# EAGLE design untitled (EAGLE 9.5.0)
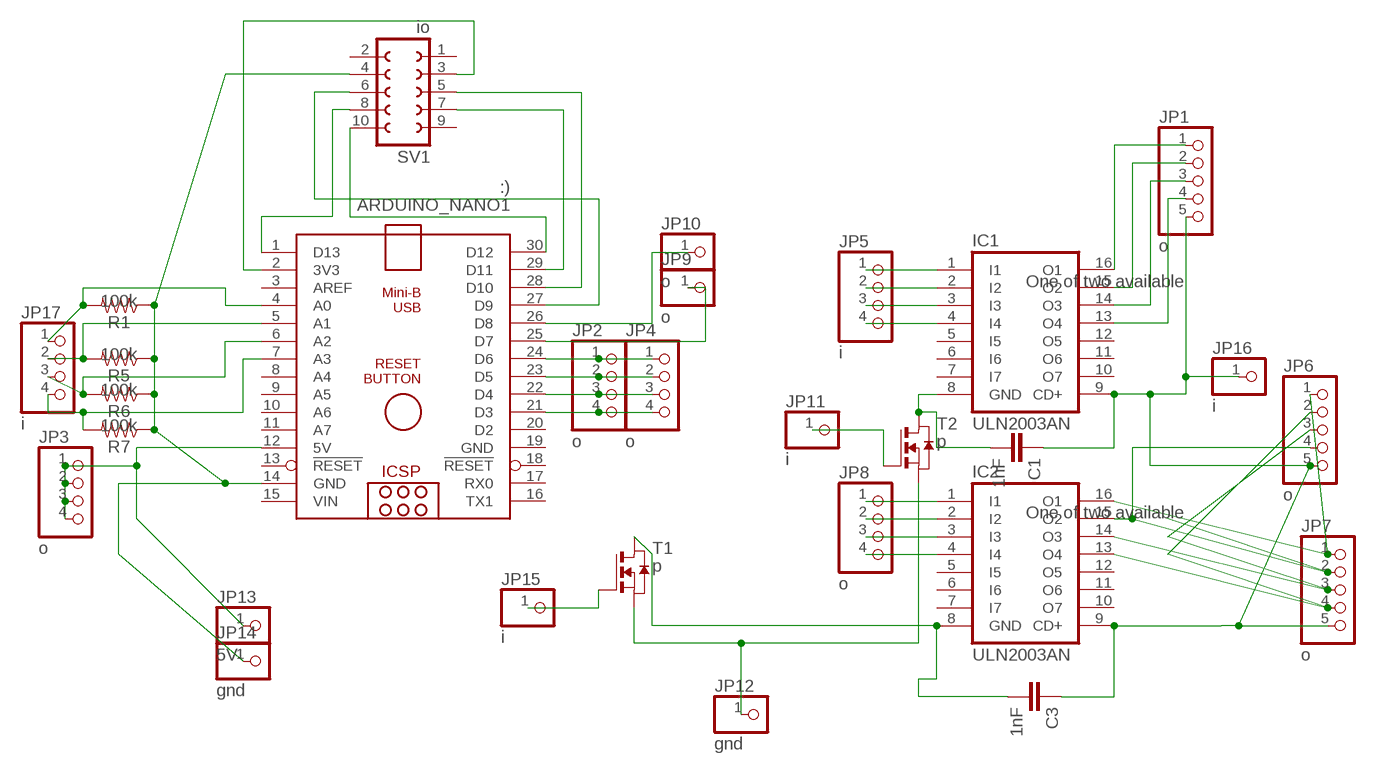
[diagram p0: schematic, sheet 1]

## Parts
ARDUINO_NANO1  :)  ARDUINO_NANO  [ARDUINO_NANO]
C1  1nF  1.0NF/1000PF-0603-50V-10%  [0603]
C3  1nF  1.0NF/1000PF-0603-50V-10%  [0603]
IC1  ULN2003AN  [DIL16]
IC2  ULN2003AN  [DIL16]
JP1  o  PINHD-1X5  [1X05]
JP2  o  PINHD-1X4  [1X04]
JP3  o  PINHD-1X4  [1X04]
JP4  o  PINHD-1X4  [1X04]
JP5  i  PINHD-1X4  [1X04]
JP6  o  PINHD-1X5  [1X05]
JP7  o  PINHD-1X5  [1X05]
JP8  o  PINHD-1X4  [1X04]
JP9  o  PINHD-1X1  [1X01]
JP10  o  PINHD-1X1  [1X01]
JP11  i  PINHD-1X1  [1X01]
JP12  gnd  PINHD-1X1  [1X01]
JP13  5V  PINHD-1X1  [1X01]
JP14  gnd  PINHD-1X1  [1X01]
JP15  i  PINHD-1X1  [1X01]
JP16  i  PINHD-1X1  [1X01]
JP17  i  PINHD-1X4  [1X04]
R1  100k  100KOHM-0603-1/10W-1%  [0603]
R5  100k  100KOHM-0603-1/10W-1%  [0603]
R6  100k  100KOHM-0603-1/10W-1%  [0603]
R7  100k  100KOHM-0603-1/10W-1%  [0603]
SV1  io  FE05-2  [FE05-2]
T1  p  NMOSSOT89  [SOT89]
T2  p  NMOSSOT89  [SOT89]

## Nets
3V3: ARDUINO_NANO1.1(D13) SV1.8
GND1: ARDUINO_NANO1.14(GND) JP14.1 R1.1 R5.1 R6.1 R7.1 SV1.4
GND2: JP12.1 T1.3(S) T2.3(S)
LONGTHINGY: IC2.15(O2) JP6.4 JP7.2
N$1: ARDUINO_NANO1.4(A0) JP17.1 R1.2
N$3: ARDUINO_NANO1.21(D3) JP2.4 JP4.4
N$4: ARDUINO_NANO1.30(D12) SV1.10
N$6: IC2.16(O1) JP6.1 JP7.1
N$8: IC2.14(O3) JP6.3 JP7.3
N$9: IC2.13(O4) JP6.2 JP7.4
N$11: IC1.16(O1) JP1.1
N$12: IC1.15(O2) JP1.2
N$13: IC1.14(O3) JP1.3
N$14: IC1.13(O4) JP1.4
N$15: ARDUINO_NANO1.22(D4) JP2.3 JP4.3
N$17: ARDUINO_NANO1.25(D7) JP9.1
N$18: ARDUINO_NANO1.23(D5) JP2.2 JP4.2
N$21: ARDUINO_NANO1.29(D11) SV1.7
N$22: ARDUINO_NANO1.28(D10) SV1.5
N$23: ARDUINO_NANO1.27(D9) SV1.6
N$24: ARDUINO_NANO1.24(D6) JP2.1 JP4.1
N$25: ARDUINO_NANO1.2(3V3) SV1.3
N$27: IC1.1(I1) JP5.1
N$28: IC1.2(I2) JP5.2
N$29: IC1.3(I3) JP5.3
N$30: IC1.4(I4) JP5.4
N$31: IC2.1(I1) JP8.1
N$32: IC2.2(I2) JP8.2
N$33: IC2.3(I3) JP8.3
N$34: IC2.4(I4) JP8.4
N$35: ARDUINO_NANO1.26(D8) JP10.1
N$36: JP11.1 T2.1(G)
N$37: JP15.1 T1.1(G)
N$39: ARDUINO_NANO1.5(A1) JP17.2 R5.2
N$40: ARDUINO_NANO1.6(A2) JP17.3 R6.2
N$41: ARDUINO_NANO1.7(A3) JP17.4 R7.2
ULN1GND: C1.2 IC1.8(GND) T2.2(D) T2.2@1(D)
ULN2GND: C3.2 IC2.8(GND) T1.2(D) T1.2@1(D)
VCC1: ARDUINO_NANO1.12(5V) JP3.1 JP3.2 JP3.3 JP3.4 JP13.1
VCC2: C1.1 C3.1 IC1.9(CD+) IC2.9(CD+) JP1.5 JP6.5 JP7.5 JP16.1
Unconnected: ARDUINO_NANO1.3(AREF) ARDUINO_NANO1.8(A4) ARDUINO_NANO1.9(A5) ARDUINO_NANO1.10(A6) ARDUINO_NANO1.11(A7) ARDUINO_NANO1.13(!RESET) ARDUINO_NANO1.16(TX1) ARDUINO_NANO1.17(RX0) ARDUINO_NANO1.18(!RESET) ARDUINO_NANO1.20(D2) IC1.5(I5) IC1.6(I6) IC1.7(I7) IC1.10(O7) IC1.11(O6) IC1.12(O5) IC2.5(I5) IC2.6(I6) IC2.7(I7) IC2.10(O7) IC2.11(O6) IC2.12(O5) SV1.1 SV1.2 SV1.9

## Power pins joined to a net without a drawn wire
GND: ARDUINO_NANO1.19(GND)
VIN: ARDUINO_NANO1.15(VIN)

## Library data of the parts
ARDUINO_NANO1 = ArduinoNanoV30:ARDUINO_NANO: Arduino Nano V3.0 Overview: The Arduino Nano is a small, complete, and breadboard-friendly board based on the ATmega328 (Arduino Nano 3.x) or ATmega168 (Arduino Nano 2.x). It has more or less the same functionality of the Arduino Duemilanove, but in a different package. It lacks only a DC power jack, and works with a Mini-B USB cable instead of a standard one. The Nano was designed and is being produced by Gravitech. Specifications: Microcontroller Atmel ATmega168 or ATmega328 Operating Voltage (logic level) 5 V Input Voltage (recommended) 7-12 V Input Voltage (limits) 6-20 V Digital I/O Pins 14 (of which 6 provide PWM output) Analog Input Pins 8 DC Current per I/O Pin 40 mA Flash Memory 16 KB (ATmega168) or 32 KB (ATmega328) of which 2 KB used by bootloader SRAM 1 KB (ATmega168) or 2 KB (ATmega328) EEPROM 512 bytes (ATmega168) or 1 KB (ATmega328) Clock Speed 16 MHz Dimensions 0.73" x 1.70" Length 45 mm Width 18 mm Weigth 5 g Power: The Arduino Nano can be powered via the Mini-B USB connection, 6-20V unregulated external power supply (pin 30), or 5V regulated external power supply (pin 27). The power source is automatically selected to the highest voltage source. Memory: The ATmega168 has 16 KB of flash memory for storing code (of which 2 KB is used for the bootloader); the ATmega328 has 32 KB, (also with 2 KB used for the bootloader). The ATmega168 has 1 KB of SRAM and 512 bytes of EEPROM (which can be read and written with the EEPROM library); the ATmega328 has 2 KB of SRAM and 1 KB of EEPROM. Input and Output: Each of the 14 digital pins on the Nano can be used as an input or output, using pinMode(), digitalWrite(), and digitalRead() functions. They operate at 5 volts. Each pin can provide or receive a maximum of 40 mA and has an internal pull-up resistor (disconnected by default) of 20-50 kOhms. In addition, some pins have specialized functions. Visit Arduino - ArduinoBoardNano <https://www.arduino.cc/en/Main/ArduinoBoardNano>
C1 C3 = SparkFun-Capacitors:1.0NF/1000PF: 1nF/1,000pF ceramic capacitors A capacitor is a passive two-terminal electrical component used to store electrical energy temporarily in an electric field.; PROD_ID: CAP-07886
IC1 IC2 = uln-udn:ULN2003A: DRIVER ARRAY; A: One of two available
JP1 JP6 JP7 = pinhead:PINHD-1X5: PIN HEADER
JP2-JP5 JP8 JP17 = pinhead:PINHD-1X4: PIN HEADER
JP9-JP16 = pinhead:PINHD-1X1: PIN HEADER
R1 R5-R7 = SparkFun-Resistors:100KOHM: 100kΩ resistor A resistor is a passive two-terminal electrical component that implements electrical resistance as a circuit element. Resistors act to reduce current flow, and, at the same time, act to lower voltage levels within circuits. - Wikipedia; PROD_ID: RES-07828
SV1 = con-lsta:FE05-2: FEMALE HEADER; OC_FARNELL: unknown; OC_NEWARK: unknown
T1 T2 = zetex:NMOSSOT89: MOS FET; OC_FARNELL: unknown; OC_NEWARK: unknown

## Board
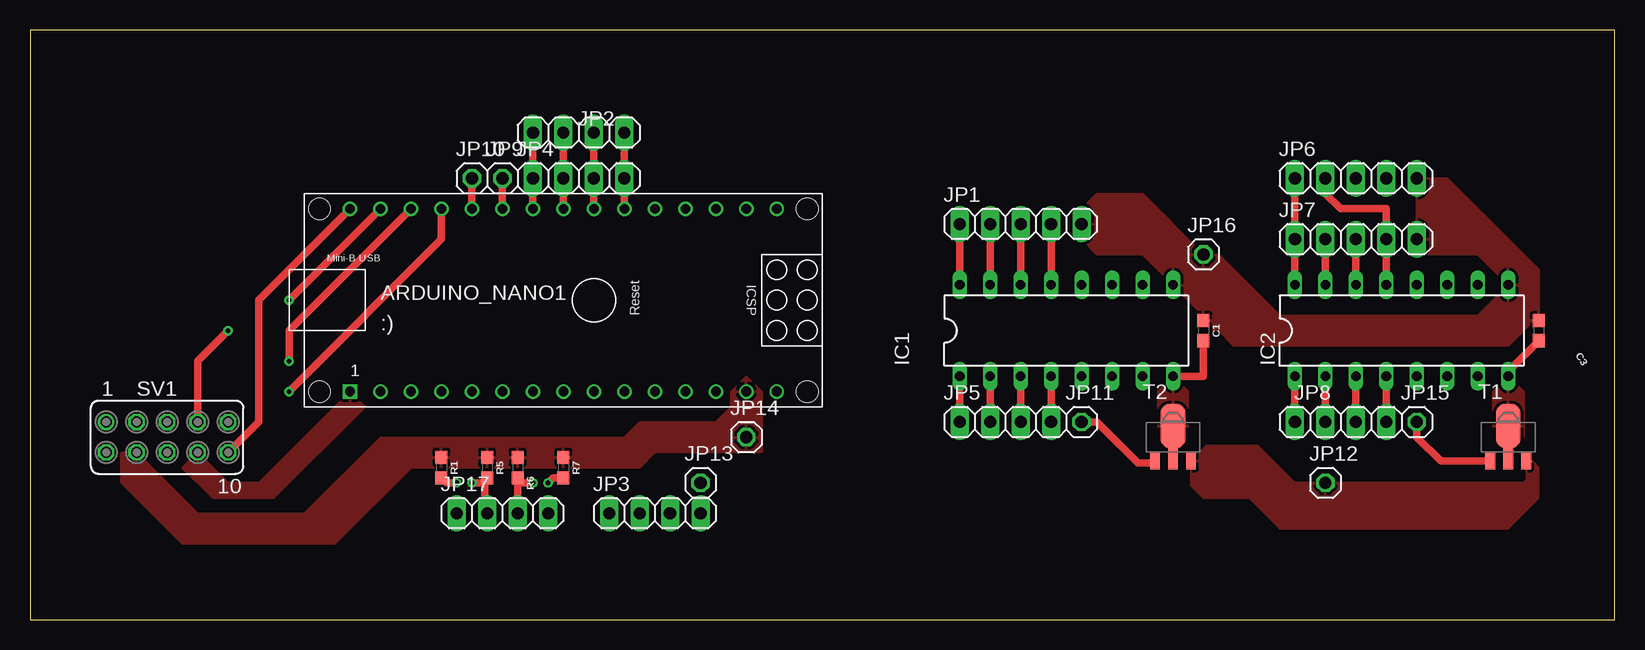
[diagram p1: board, top side]
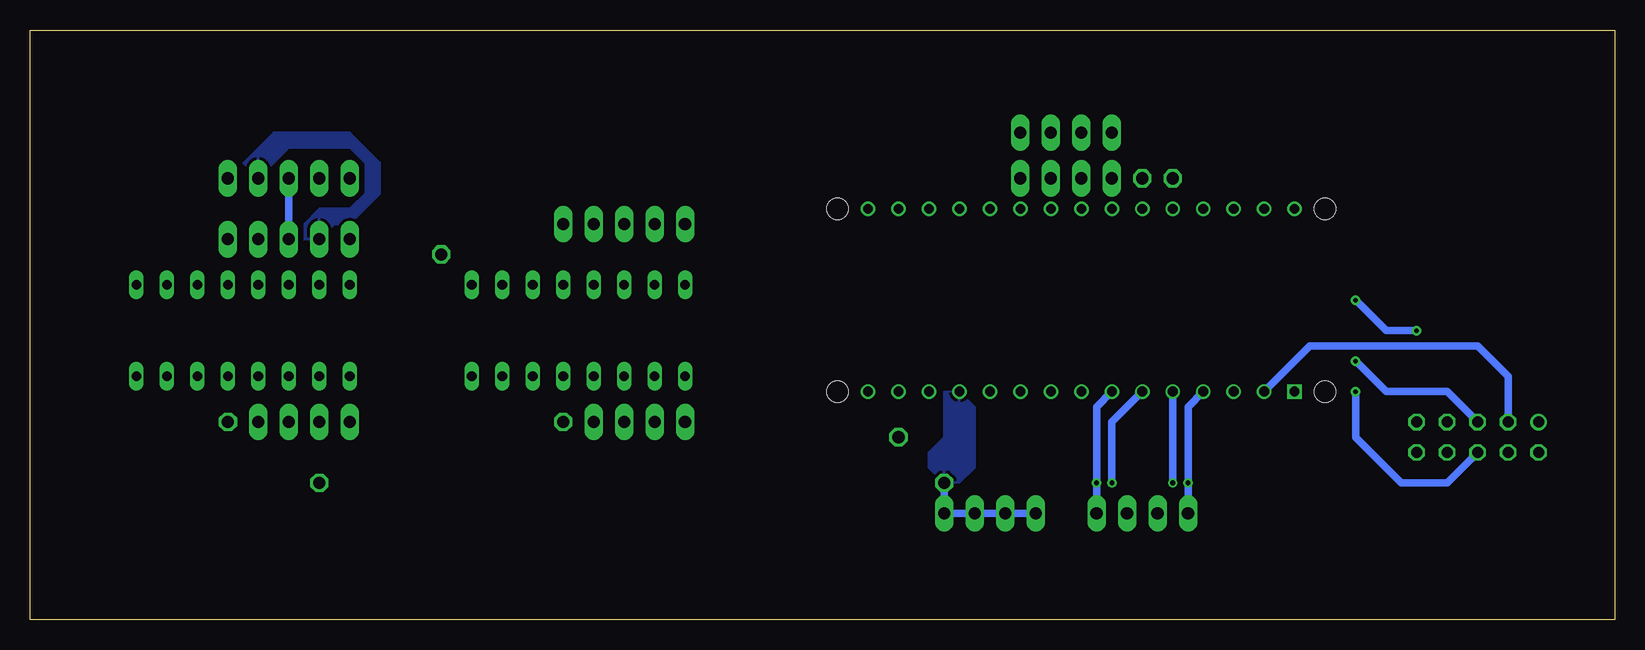
[diagram p2: board, bottom side, seen from below]

Size 132.06 x 49.2 mm. Coordinates in mm from the lower left corner, seen from the top.
Outline: 0,0 132.06,0 132.06,49.2 0,49.2 0,0
Copper layers (1*16): Top 0.035mm / dielectric 1.5mm / Bottom 0.035mm
Design rules "Standard": minimum track width 10mil, minimum drill 15mil, track to track 10mil, track to pad 10mil, pad to pad 10mil, via to via 10mil, smd to smd 10mil, copper to edge 20mil, drill to drill 10mil, minimum pad ring 8mil, minimum via ring 8mil, stop-mask expansion 4mil, vias tented up to drill 0mil, thermal gap 10mil

### Footprints (pad centres in the part's own frame; a part is rotated, then mirrored left to right if it is on the bottom)
ARDUINO_NANO = drill 0.8 square: 1 -20.32,-7.62 | drill 0.8: 2 -17.78,-7.62; 3 -15.24,-7.62; 4 -12.7,-7.62; 5 -10.16,-7.62; 6 -7.62,-7.62; 7 -5.08,-7.62; 8 -2.54,-7.62; 9 0,-7.62; 10 2.54,-7.62; 11 5.08,-7.62; 12 7.62,-7.62; 13 10.16,-7.62; 14 12.7,-7.62; 15 15.24,-7.62; 16 15.24,7.62; 17 12.7,7.62; 18 10.16,7.62; 19 7.62,7.62; 20 5.08,7.62; 21 2.54,7.62; 22 0,7.62; 23 -2.54,7.62; 24 -5.08,7.62; 25 -7.62,7.62; 26 -10.16,7.62; 27 -12.7,7.62; 28 -15.24,7.62; 29 -17.78,7.62; 30 -20.32,7.62 | hole 1.778: -22.86,-7.62; -22.86,7.62; 17.78,7.62; 17.78,-7.62
0603 = smd 1.1 x 1: 1 -0.85,0; 2 0.85,0
DIL16 = drill 0.813 long: 1 -8.89,-3.81; 2 -6.35,-3.81; 3 -3.81,-3.81; 4 -1.27,-3.81; 5 1.27,-3.81; 6 3.81,-3.81; 7 6.35,-3.81; 8 8.89,-3.81; 9 8.89,3.81; 10 6.35,3.81; 11 3.81,3.81; 12 1.27,3.81; 13 -1.27,3.81; 14 -3.81,3.81; 15 -6.35,3.81; 16 -8.89,3.81
1X05 = drill 1.016 long: 1 -5.08,0; 2 -2.54,0; 3 0,0; 4 2.54,0; 5 5.08,0
1X04 = drill 1.016 long: 1 -3.81,0; 2 -1.27,0; 3 1.27,0; 4 3.81,0
1X01 = drill 1.016 octagon: 1 0,0
FE05-2 = drill 0.914: 1 -5.08,1.27 | drill 0.914 octagon: 2 -5.08,-1.27; 3 -2.54,1.27; 4 -2.54,-1.27; 5 0,1.27; 6 0,-1.27; 7 2.54,1.27; 8 2.54,-1.27; 9 5.08,1.27; 10 5.08,-1.27
SOT89 = smd 0.8 x 1.4: 1 -1.499,-1.981; 3 1.499,-1.981 | smd 0.8 x 1.9: 2 0,-1.727 | smd 2.032 x 3.65: 2@1 0,0.94

### Placement (x,y rotation side)
ARDUINO_NANO1  46.99,26.67 0 top
C1  97.79,24.13 270 top
C3  125.73,24.13 270 top
IC1  86.36,24.13 0 top
IC2  114.3,24.13 0 top
JP1  82.55,33.02 0 top
JP2  45.72,40.64 0 top
JP3  52.07,8.89 0 top
JP4  45.72,36.83 0 top
JP5  81.28,16.51 0 top
JP6  110.49,36.83 0 top
JP7  110.49,31.75 0 top
JP8  109.22,16.51 0 top
JP9  39.37,36.83 0 top
JP10  36.83,36.83 0 top
JP11  87.63,16.51 0 top
JP12  107.95,11.43 0 top
JP13  55.88,11.43 0 top
JP14  59.69,15.24 0 top
JP15  115.57,16.51 0 top
JP16  97.79,30.48 0 top
JP17  39.37,8.89 0 top
R1  34.29,12.7 270 top
R5  38.1,12.7 270 top
R6  40.64,12.7 270 top
R7  44.45,12.7 270 top
SV1  11.43,15.24 0 top
T1  123.19,15.24 0 top
T2  95.25,15.24 0 top

### Tracks (layer width: path | path; a pad name or v marks a point on that pad's centre or on a via)
3V3
  pour Top: 26.67,19.05 19.05,11.43 16.51,11.43 13.97,13.97 12.7,12.7 15.24,10.16 20.32,10.16 27.94,17.78
GND1
  pour Top (isolate 0.254): 12.7,6.35 7.62,11.43 7.62,13.97 8.89,13.97 13.97,8.89 22.86,8.89 29.21,15.24 49.53,15.24 50.8,16.51 57.15,16.51 58.42,17.78 58.42,19.05 59.69,20.32 60.96,19.05 60.96,13.97 52.07,13.97 50.8,12.7 31.75,12.7 25.4,6.35
GND2
  pour Top: 96.75,13.26 96.75,11.2 97.79,10.16 101.6,10.16 104.14,7.62 123.19,7.62 125.73,10.16 125.73,12.7 125.17,13.26 124.69,13.26 124.69,11.66 124.46,11.43 105.41,11.43 102.31,14.53 98.02,14.53
LONGTHINGY
  Top 0.635: IC2.15 JP7.2
  pour Bottom: 113.03,36.83 110.49,39.37 105.41,39.37 104.14,38.1 104.14,35.56 105.41,34.29 107.95,34.29 109.22,33.02 109.22,31.75 107.95,31.75 106.68,33.02 105.41,33.02 102.87,35.56 102.87,38.1 105.41,40.64 111.76,40.64 114.3,38.1
N$1  (via drill 0.38)
  Top 0.635: v35.56,11.43 34.71,11.43 R1.2
  Bottom 0.635: JP17.1 v35.56,11.43 35.56,17.78 ARDUINO_NANO1.4
N$3
  Top 0.635: JP2.4 JP4.4 ARDUINO_NANO1.21
N$4
  Top 0.635: ARDUINO_NANO1.30 19.05,26.67 19.05,16.51 SV1.10
N$6
  Top 0.635: IC2.16 JP7.1 JP6.1
N$8
  Top 0.635: JP7.3 IC2.14
  Bottom 0.635: JP7.3 JP6.3
N$9
  Top 0.635: IC2.13 JP7.4 113.03,34.29 109.22,34.29 107.95,35.56 JP6.2
N$11
  Top 0.635: IC1.16 JP1.1
N$12
  Top 0.635: JP1.2 IC1.15
N$13
  Top 0.635: IC1.14 JP1.3
N$14
  Top 0.635: JP1.4 IC1.13
N$15
  Top 0.635: ARDUINO_NANO1.22 JP4.3 JP2.3
N$17
  Top 0.635: ARDUINO_NANO1.25 JP9.1
N$18
  Top 0.635: JP2.2 JP4.2 ARDUINO_NANO1.23
N$21  (via drill 0.38)
  Top 0.635: ARDUINO_NANO1.29 v21.59,26.67 | v16.51,24.13 13.97,21.59 SV1.7
  Bottom 0.635: v21.59,26.67 19.05,24.13 v16.51,24.13
N$22  (via drill 0.38)
  Top 0.635: ARDUINO_NANO1.28 21.59,24.13 v21.59,21.59
  Bottom 0.635: v21.59,21.59 19.05,19.05 13.97,19.05 SV1.5
N$23  (via drill 0.38)
  Top 0.635: v21.59,19.05 34.29,31.75 ARDUINO_NANO1.27
  Bottom 0.635: SV1.6 13.97,11.43 17.78,11.43 21.59,15.24 v21.59,19.05
N$24
  Top 0.635: ARDUINO_NANO1.24 JP4.1 JP2.1
N$25
  Bottom 0.635: SV1.3 8.89,20.32 11.43,22.86 25.4,22.86 ARDUINO_NANO1.2
N$27
  Top 0.635: IC1.1 JP5.1
N$28
  Top 0.635: JP5.2 IC1.2
N$29
  Top 0.635: JP5.3 IC1.3
N$30
  Top 0.635: IC1.4 JP5.4
N$31
  Top 0.635: IC2.1 JP8.1
N$32
  Top 0.635: JP8.2 IC2.2
N$33
  Top 0.635: IC2.3 JP8.3
N$34
  Top 0.635: JP8.4 IC2.4
N$35
  Top 0.635: ARDUINO_NANO1.26 JP10.1
N$36
  Top 0.635: T2.1 93.59,13.09 92.32,13.09 88.9,16.51 JP11.1
N$37
  Top 0.635: T1.1 117.55,13.26 115.57,15.24 JP15.1
N$39  (via drill 0.38)
  Top 0.635: 37.89,11.64 37.68,11.43 v36.83,11.43 | JP17.2 37.89,9.1 37.89,11.64 | R5.2 37.89,11.64
  Bottom 0.635: v36.83,11.43 ARDUINO_NANO1.5
N$40  (via drill 0.38)
  Top 0.635: JP17.3 40.64,11.43 40.85,11.64 | v41.91,11.43 41.06,11.43 40.85,11.64 | R6.2 40.85,11.64
  Bottom 0.635: v41.91,11.43 41.91,16.51 ARDUINO_NANO1.6
N$41  (via drill 0.38)
  Top 0.635: v43.18,11.43 43.6,11.85 R7.2
  Bottom 0.635: ARDUINO_NANO1.7 43.18,17.78 v43.18,11.43 JP17.4
ULN1GND
  Top 0.635: IC1.8 97.79,20.32 C1.2
  pour Top: 95.25,20.32 93.98,19.05 93.98,15.24 95.25,13.97 96.52,15.24 96.52,19.05
ULN2GND
  Top 0.635: C3.2 123.19,20.74 IC2.8
  pour Top: 123.19,13.97 121.92,15.24 121.92,19.05 123.19,20.32 124.46,19.05 124.46,15.24
VCC1
  Bottom 0.635: JP3.1 JP3.2 JP3.3 JP3.4 JP13.1
  pour Bottom: 54.61,19.05 53.34,17.78 53.34,12.7 54.61,11.43 55.88,11.43 57.15,12.7 57.15,13.97 55.88,15.24 55.88,19.05
VCC2
  pour Top: 88.9,30.48 87.63,31.75 87.63,34.29 88.9,35.56 92.71,35.56 97.79,30.48 99.06,30.48 104.14,25.4 120.65,25.4 123.19,27.94 120.65,30.48 115.57,30.48 115.57,36.83 118.11,36.83 125.73,29.21 125.73,25.4 123.19,22.86 100.33,22.86 99.06,24.13 98.64,24.13 97.79,24.98 97.79,25.4 92.71,30.48